# EAGLE design picoPromSD (EAGLE 9.5.1)
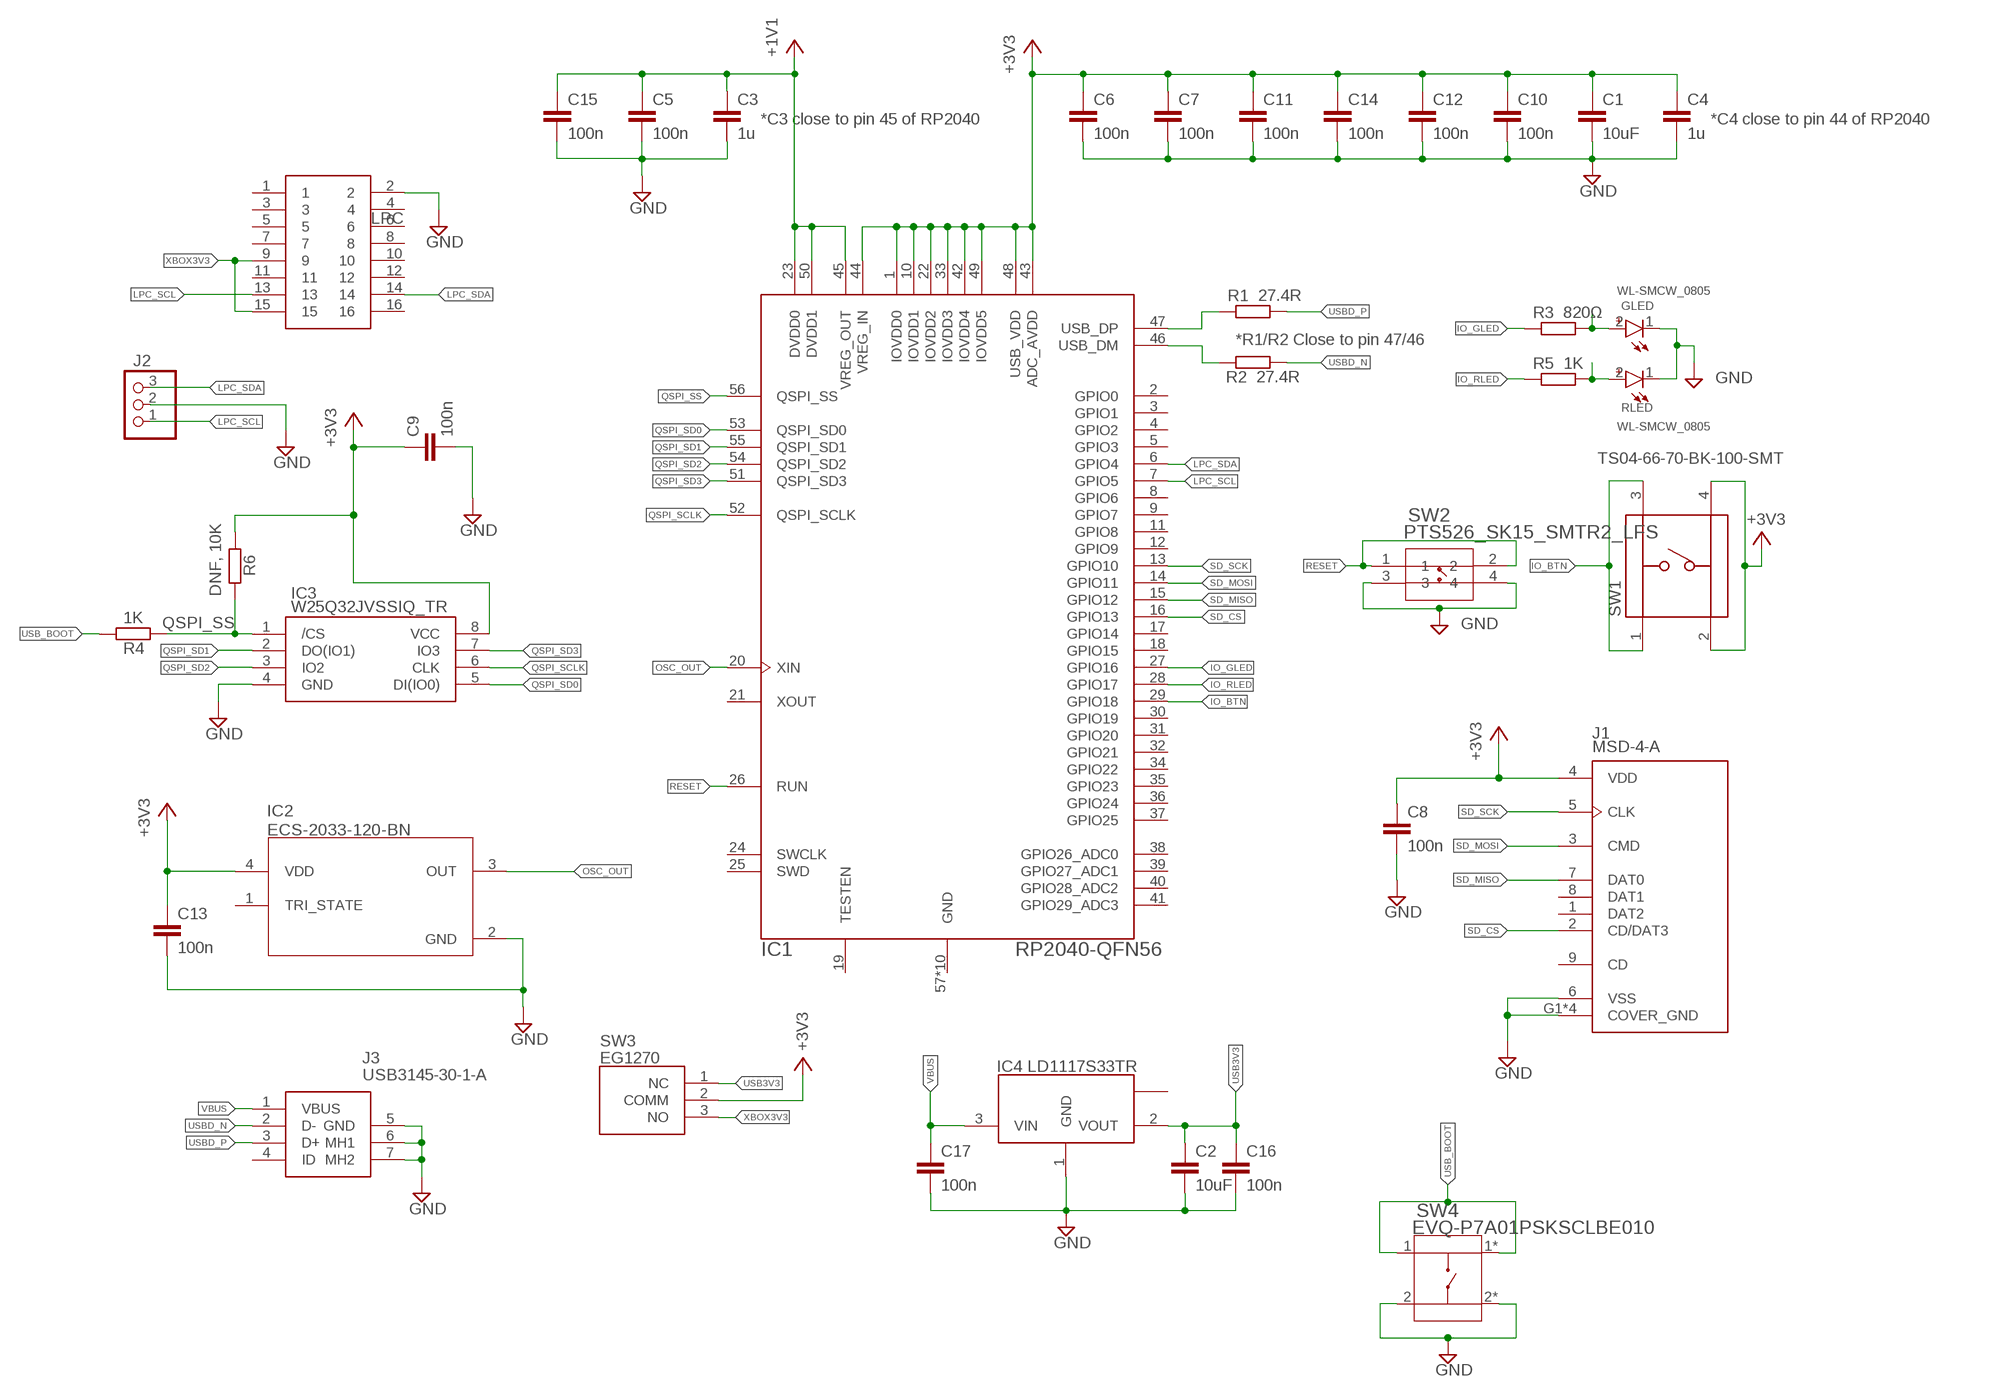
[diagram p0: schematic, sheet 1]

## Parts
C1  10uF  C-EUC0603  [C0603]
C2  10uF  C-EUC0603  [C0603]
C3  1u  CAPACITOR0402  [C0402]
C4  1u  CAPACITOR0402  [C0402]
C5  100n  CAPACITOR0402  [C0402]
C6  100n  CAPACITOR0402  [C0402]
C7  100n  CAPACITOR0402  [C0402]
C8  100n  CAPACITOR0402  [C0402]
C9  100n  CAPACITOR0402  [C0402]
C10  100n  CAPACITOR0402  [C0402]
C11  100n  CAPACITOR0402  [C0402]
C12  100n  CAPACITOR0402  [C0402]
C13  100n  CAPACITOR0402  [C0402]
C14  100n  CAPACITOR0402  [C0402]
C15  100n  CAPACITOR0402  [C0402]
C16  100n  CAPACITOR0402  [C0402]
C17  100n  CAPACITOR0402  [C0402]
GLED  WL-SMCW_0805  [WL-SMCW_0805]
IC1  RP2040-QFN56  [RP2040-QFN-56]
IC2  ECS-2033-120-BN  [OSC_ECS-2033-120-BN]
IC3  W25Q32JVSSIQ_TR  [SOIC127P790X216-8N]
IC4  LD1117S33TR  [SOT223]
J1  MSD-4-A  [CUI_MSD-4-A]
J2  PINHEAD_2.54MM_1X3  [PINHEAD_2.54MM_1X3]
J3  USB3145-30-1-A  [USB3145301A]
LPC  PINHEAD_2.54MM_2X8  [PINHEAD_2.54MM_2X8]
R1  27.4R  RESISTOR  [R0402]
R2  27.4R  RESISTOR  [R0402]
R3  820Ω  RESISTOR  [R0402]
R4  1K  RESISTOR  [R0402]
R5  1K  RESISTOR  [R0402]
R6  DNF, 10K  RESISTOR  [R0402]
RLED  WL-SMCW_0805  [WL-SMCW_0805]
SW1  TS04-66-70-BK-100-SMT  [SW_TS04-66-70-BK-100-SMT]
SW2  PTS526_SK15_SMTR2_LFS  [SMT_FS]
SW3  EG1270  [EG1270]
SW4  EVQ-P7A01PSKSCLBE010  [SKSCLBE010]

## Nets
+3V3 [Power]: C1.1 C4.1 C6.1 C7.1 C8.1 C9.1 C10.1 C11.1 C12.1 C13.1 C14.1 IC1.1(IOVDD0) IC1.10(IOVDD1) IC1.22(IOVDD2) IC1.33(IOVDD3) IC1.42(IOVDD4) IC1.43(ADC_AVDD) IC1.44(VREG_IN) IC1.48(USB_VDD) IC1.49(IOVDD5) IC2.4(VDD) IC3.8(VCC) J1.4(VDD) R6.2 SW1.2 SW1.4 SW3.2(COMM)
GND: C1.2 C2.2 C3.2 C4.2 C5.2 C6.2 C7.2 C8.2 C9.2 C10.2 C11.2 C12.2 C13.2 C14.2 C15.2 C16.2 C17.2 GLED.1(-) IC2.2(GND) IC3.4(GND) IC4.1(GND) J1.6(VSS) J1.G1(COVER_GND) J1.G2(COVER_GND) J1.G3(COVER_GND) J1.G4(COVER_GND) J2.2 J3.5(GND) J3.6(MH1) J3.7(MH2) LPC.2 RLED.1(-) SW2.3 SW2.4 SW4.2 SW4.2*(!)
IO_BTN: IC1.29(GPIO18) SW1.1 SW1.3
IO_GLED: IC1.27(GPIO16) R3.1
IO_GLED2: GLED.2(+) R3.2
IO_RLED: IC1.28(GPIO17) R5.1
IO_RLED2: R5.2 RLED.2(+)
LPC_SCL: IC1.7(GPIO5) J2.1 LPC.13
LPC_SDA: IC1.6(GPIO4) J2.3 LPC.14
OSC_OUT: IC1.20(XIN) IC2.3(OUT)
PUSBD_N [USB]: IC1.46(USB_DM) R2.1
PUSBD_P [USB]: IC1.47(USB_DP) R1.1
QSPI_SCLK: IC1.52(QSPI_SCLK) IC3.6(CLK)
QSPI_SD0: IC1.53(QSPI_SD0) IC3.5(DI(IO0))
QSPI_SD1: IC1.55(QSPI_SD1) IC3.2(DO(IO1))
QSPI_SD2: IC1.54(QSPI_SD2) IC3.3(IO2)
QSPI_SD3: IC1.51(QSPI_SD3) IC3.7(IO3)
QSPI_SS: IC1.56(QSPI_SS) IC3.1(/CS) R4.2 R6.1
RESET: IC1.26(RUN) SW2.1 SW2.2
SD_CS: IC1.16(GPIO13) J1.2(CD/DAT3)
SD_MISO: IC1.15(GPIO12) J1.7(DAT0)
SD_MOSI: IC1.14(GPIO11) J1.3(CMD)
SD_SCK: IC1.13(GPIO10) J1.5(CLK)
USB3V3 [Power]: C2.1 C16.1 IC4.2(VOUT) SW3.1(NC)
USB_BOOT: R4.1 SW4.1 SW4.1*(!_2)
USBD_N [USB]: J3.2(D-) R2.2
USBD_P [USB]: J3.3(D+) R1.2
VBUS [Power]: C17.1 IC4.3(VIN) J3.1(VBUS)
VCC: C3.1 C5.1 C15.1 IC1.23(DVDD0) IC1.45(VREG_OUT) IC1.50(DVDD1) ; supply symbol labelled +1V1
XBOX3V3 [Power]: LPC.9 LPC.15 SW3.3(NO)
Unconnected: IC1.2(GPIO0) IC1.3(GPIO1) IC1.4(GPIO2) IC1.5(GPIO3) IC1.8(GPIO6) IC1.9(GPIO7) IC1.11(GPIO8) IC1.12(GPIO9) IC1.17(GPIO14) IC1.18(GPIO15) IC1.19(TESTEN) IC1.21(XOUT) IC1.24(SWCLK) IC1.25(SWD) IC1.30(GPIO19) IC1.31(GPIO20) IC1.32(GPIO21) IC1.34(GPIO22) IC1.35(GPIO23) IC1.36(GPIO24) IC1.37(GPIO25) IC1.38(GPIO26_ADC0) IC1.39(GPIO27_ADC1) IC1.40(GPIO28_ADC2) IC1.41(GPIO29_ADC3) IC2.1(TRI_STATE) IC4.4(HEATSINK) J1.1(DAT2) J1.8(DAT1) J1.9(CD) J3.4(ID) LPC.1 LPC.3 LPC.4 LPC.5 LPC.6 LPC.7 LPC.8 LPC.10 LPC.11 LPC.12 LPC.16

## Notes on the sheet
- *C3 close to pin 45 of RP2040 | *C4 close to pin 44 of RP2040
- *R1/R2 Close to pin 47/46

## Power pins joined to a net without a drawn wire
GND: IC1.57(GND) IC1.58(GND) IC1.59(GND) IC1.60(GND) IC1.61(GND) IC1.62(GND) IC1.63(GND) IC1.64(GND) IC1.65(GND) IC1.66(GND)

## Library data of the parts
C1 C2 = rcl:C-EU: CAPACITOR, European symbol; SPICEPREFIX: C
C3-C17 = PicoPromSDParts:CAPACITOR
GLED RLED = PicoPromSDParts:WL-SMCW_0805: WL-SMCW SMT Mono-color Chip LED Waterclea Characteristics Low energy consumption High reliability Low current requirement Fast switching No UV/IR radiation Smallest SMD LED package for exceptional brightness Top view LED Wide viewing angle Better solder ability Heat dissipation Applications Backlight for mobile and portable device keypads Indoor and outdoor message boards Flat backlight for LCDs, switches and symbols Display for industrial control systems and traffic Miniaturized color effects Pedestrian mark Optical indicators Tabular backlight: LCD, telephone key-press, power-switch, display board Indoor displays Signals Identifiers Backlight for automobile DVD LED General lighting Toys <https://www.we-online.com/catalog/media/o14904v209%20Family_WL-SMCW.jpg> Details see: www.we-online.com/catalog/WL-SMCW <www.we-online.com/catalog/WL-SMCW/?utm_source=eagle_model&utm_medium=description_link&utm_campaign=eisos_eagle> Updated by Ella Wu, 2022-06-16 2022(C) Wurth Elektronik
IC1 = RpiPico:RP2040-QFN56
IC2 = PicoPromSDParts:ECS-2033-120-BN: subminiature SMD oscillators; MANUFACTURER: ECS Inc; PARTREV: 11/15/13; STANDARD: Manufacturer Recommendations
IC3 = W25Q32JVSSIQ_TR:W25Q32JVSSIQ_TR: NOR Flash spiFlash, 32M-bit, DTR, 4Kb Uniform Sector Source: Datasheet <https://www.winbond.com/resource-files/w25q32jv spi revc 08302016.pdf>; DESCRIPTION: NOR Flash spiFlash, 32M-bit, DTR, 4Kb Uniform Sector; HEIGHT: 2.16mm; MANUFACTURER_NAME: Winbond; MANUFACTURER_PART_NUMBER: W25Q32JVSSIQ TR; MOUSER_PART_NUMBER: 454-W25Q32JVSSIQTR; MOUSER_PRICE-STOCK: https://www.mouser.co.uk/ProductDetail/Winbond/W25Q32JVSSIQ-TR?qs=qSfuJ%252Bfl%2Fd73AdQzQa%2FEuA%3D%3D
IC4 = SamacSys_Parts:LD1117S33TR: LDO Voltage Regulators 3.3V 0.8A Positive Source: Datasheet <https://datasheet.lcsc.com/szlcsc/STMicroelectronics-LD1117S33TR_C86781.pdf>
J1 = PicoPromSDParts:MSD-4-A; MANUFACTURER: CUI Devices; MAXIMUM_PACKAGE_HEIGHT: 2.00mm; PARTREV: 1.0; STANDARD: Manufacturer Recommendations
J2 = PicoPromSDParts:PINHEAD_2.54MM_1X3
J3 = USB3145-30-1-A:USB3145-30-1-A: GCT (GLOBAL CONNECTOR TECHNOLOGY) - USB3145-30-1-A - MICRO USB, 2.0 TYPE B, RECEPTACLE, TH Source: Datasheet; DESCRIPTION: GCT (GLOBAL CONNECTOR TECHNOLOGY) - USB3145-30-1-A - MICRO USB, 2.0 TYPE B, RECEPTACLE, TH; HEIGHT: mm; MANUFACTURER_NAME: GCT (GLOBAL CONNECTOR TECHNOLOGY); MANUFACTURER_PART_NUMBER: USB3145-30-1-A; MOUSER_PART_NUMBER: 640-USB3145-30-1-A; MOUSER_PRICE-STOCK: https://www.mouser.co.uk/ProductDetail/GCT/USB3145-30-1-A?qs=KUoIvG%2F9IlYD1lvSRu5iyg%3D%3D
LPC = PicoPromSDParts:PINHEAD_2.54MM_2X8
R1-R6 = PicoPromSDParts:RESISTOR
SW1 = SamacSys_Parts:TS04-66-70-BK-100-SMT: Check availability <https://pricing.snapeda.com/parts/TS04-66-70-BK-100-SMT/CUI%20Devices/view-part?ref=eda>; AVAILABILITY: In Stock; CUI_PURCHASE_URL: https://www.cuidevices.com/product/switches/tactile-switches/ts04-series?utm_source=snapeda.com&utm_medium=referral&utm_campaign=snapedaBOM; DESCRIPTION: 6 x 6 mm, 4.3~9.5 mm Actuator Height, 100~260 gf, Surface Mount, SPST, Tactile Switch; MF: CUI Devices; MP: TS04-66-70-BK-100-SMT; PACKAGE: None; PRICE: None; PURCHASE-URL: https://pricing.snapeda.com/search/part/TS04-66-70-BK-100-SMT/?ref=eda
SW2 = PicoPromSDParts:PTS526_SK15_SMTR2_LFS; COPYRIGHT: Copyright (C) 2024 Ultra Librarian. All rights reserved.; MANUFACTURER_PART_NUMBER: PTS526 SK15 SMTR2 LFS; MFR_NAME: C&K Components
SW3 = EG1270:EG1270: E-SWITCH - EG1270 - SWITCH, SLIDE, SPDT, 300mA, 6V, PCB Source: Datasheet <https://componentsearchengine.com/Datasheets/1/EG1270.pdf>; DESCRIPTION: E-SWITCH - EG1270 - SWITCH, SLIDE, SPDT, 300mA, 6V, PCB; HEIGHT: 4.6mm; MANUFACTURER_NAME: E-Switch; MANUFACTURER_PART_NUMBER: EG1270; MOUSER_PART_NUMBER: 612-EG1270; MOUSER_PRICE-STOCK: https://www.mouser.co.uk/ProductDetail/E-Switch/EG1270?qs=xDsBkp9LkodMM2ilVTltow%3D%3D
SW4 = PicoPromSDParts:EVQ-P7A01P

## Net classes
1 USB: width 0.24 mm
2 Power: width 0.006 mm

## Board
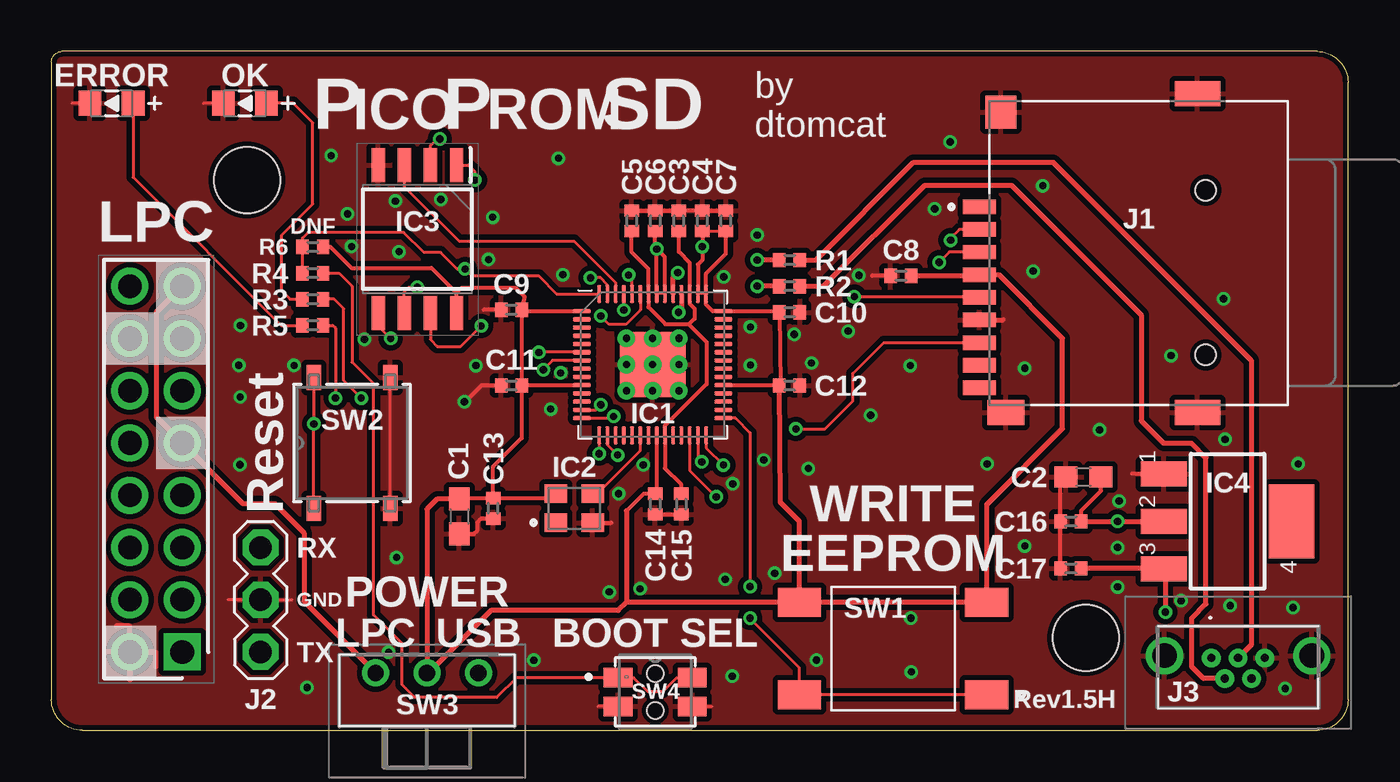
[diagram p1: board, top side]
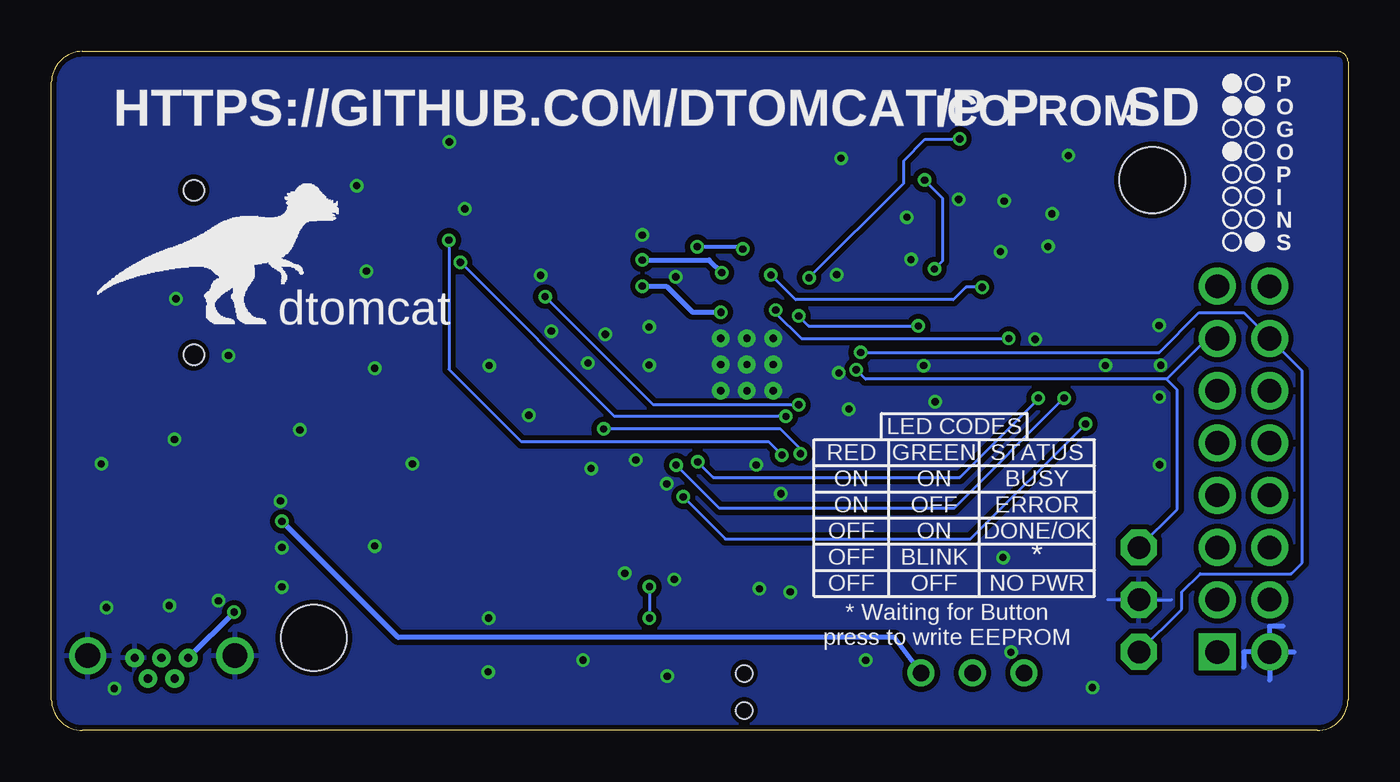
[diagram p2: board, bottom side, seen from below]

Size 63 x 33 mm. Coordinates in mm from the lower left corner, seen from the top.
Outline: 1.5,0 61.5,0 arc90 63,1.5 63,31.5 arc90 61.5,33 0.5,33 arc90 0,32.5 0,1.5 arc90 1.5,0
Copper layers (1*16): Top 0.035mm / dielectric 1.5mm / Bottom 0.035mm
Design rules "pcbway-20170911": minimum track width 6mil, minimum drill 0.3mm, track to track 6mil, track to pad 6mil, pad to pad 6mil, via to via 6mil, smd to smd 0mil, copper to edge 10mil, drill to drill 10mil, minimum pad ring 10mil, minimum via ring 6mil, stop-mask expansion 2mil, vias tented up to drill 100mil, thermal gap 10mil
Holes 3.2 mm at 50.25,4.5 9.5,26.75

### Footprints (pad centres in the part's own frame; a part is rotated, then mirrored left to right if it is on the bottom)
C0603 = smd 1.1 x 1: 1 -0.85,0; 2 0.85,0
C0402 = smd 0.6 x 0.7: 1 -0.5,0; 2 0.5,0
WL-SMCW_0805 = smd 1.1 x 1.2: 1 -1.05,0; 2 1.05,0
RP2040-QFN-56 = smd 0.875 x 0.2: 1 -3.438,2.6; 2 -3.438,2.2; 3 -3.438,1.8; 4 -3.438,1.4; 5 -3.438,1; 6 -3.438,0.6; 7 -3.438,0.2; 8 -3.438,-0.2; 9 -3.438,-0.6; 10 -3.438,-1; 11 -3.438,-1.4; 12 -3.438,-1.8; 13 -3.438,-2.2; 14 -3.438,-2.6; 29 3.438,-2.6; 30 3.438,-2.2; 31 3.438,-1.8; 32 3.438,-1.4; 33 3.438,-1; 34 3.438,-0.6; 35 3.438,-0.2; 36 3.438,0.2; 37 3.438,0.6; 38 3.438,1; 39 3.438,1.4; 40 3.438,1.8; 41 3.438,2.2; 42 3.438,2.6 | smd 0.2 x 0.875: 15 -2.6,-3.438; 16 -2.2,-3.438; 17 -1.8,-3.438; 18 -1.4,-3.438; 19 -1,-3.438; 20 -0.6,-3.438; 21 -0.2,-3.438; 22 0.2,-3.438; 23 0.6,-3.438; 24 1,-3.438; 25 1.4,-3.438; 26 1.8,-3.438; 27 2.2,-3.438; 28 2.6,-3.438; 43 2.6,3.438; 44 2.2,3.438; 45 1.8,3.438; 46 1.4,3.438; 47 1,3.438; 48 0.6,3.438; 49 0.2,3.438; 50 -0.2,3.438; 51 -0.6,3.438; 52 -1,3.438; 53 -1.4,3.438; 54 -1.8,3.438; 55 -2.2,3.438; 56 -2.6,3.438 | smd 3.2 x 3.2: 57 0,0 | drill 0.35 pad 0.6: 58 -1.275,1.275; 59 0,1.275; 60 1.275,1.275; 61 -1.275,0; 62 0,0; 63 1.275,0; 64 -1.275,-1.275; 65 0,-1.275; 66 1.275,-1.275
OSC_ECS-2033-120-BN = smd 1.1 x 0.9: 1 -0.9,-0.7; 2 0.9,-0.7; 3 0.9,0.7; 4 -0.9,0.7
SOIC127P790X216-8N = smd 1.65 x 0.65: 1 -3.6,1.905; 2 -3.6,0.635; 3 -3.6,-0.635; 4 -3.6,-1.905; 5 3.6,-1.905; 6 3.6,-0.635; 7 3.6,0.635; 8 3.6,1.905
SOT223 = smd 1.219 x 2.235: 1 -2.311,-3.099; 2 0,-3.099; 3 2.311,-3.099 | smd 3.6 x 2.2: 4 0,3.099
CUI_MSD-4-A = smd 0.7 x 1.6: 1 2.25,7.75; 2 1.15,7.75; 3 0.05,7.75; 4 -1.05,7.75; 5 -2.15,7.75; 6 -3.25,7.75; 7 -4.35,7.75; 8 -5.45,7.75; 9 -6.55,7.75 | smd 1.2 x 1.8: G1 -7.75,6.45 | smd 1.6 x 1.5: G2 6.85,6.7 | smd 1.2 x 2.2: G3 -7.75,-2.85; G4 7.75,-2.85 | hole 1: -4.95,-3.25; 3.05,-3.25
PINHEAD_2.54MM_1X3 = drill 1.1 pad 1.75 octagon: 1 2.54,0; 2 0,0; 3 -2.54,0
USB3145301A = drill 0.4 pad 0.8: 1 -1.3,0.22; 2 -0.65,-0.78; 3 0,0.22; 4 0.65,-0.78; 5 1.3,0.22 | drill 1.202 pad 1.803: 6 -3.575,0.33; 7 3.575,0.33
PINHEAD_2.54MM_2X8 = drill 1.15 pad 1.8 square: 1 -8.89,-1.27 | drill 1.15 pad 1.8: 2 -8.89,1.27; 3 -6.35,-1.27; 4 -6.35,1.27; 5 -3.81,-1.27; 6 -3.81,1.27; 7 -1.27,-1.27; 8 -1.27,1.27; 9 1.27,-1.27; 10 1.27,1.27; 11 3.81,-1.27; 12 3.81,1.27; 13 6.35,-1.27; 14 6.35,1.27; 15 8.89,-1.27; 16 8.89,1.27
R0402 = smd 0.6 x 0.7: 1 -0.5,0; 2 0.5,0
SW_TS04-66-70-BK-100-SMT = smd 2.1 x 1.4: 1 -4.55,2.25; 2 -4.55,-2.25; 3 4.55,2.25; 4 4.55,-2.25
SMT_FS = smd 1.2 x 0.7: 1 -3.181,1.854; 2 3.181,1.854; 3 -3.181,-1.854; 4 3.181,-1.854
EG1270 = drill 0.8 pad 1.3: 1 0,0; 2 0,2.5; 3 0,5
SKSCLBE010 = smd 1.4 x 0.95: 1 -1.8,0.7; 1* 1.8,0.7; 2 -1.8,-0.7; 2* 1.8,-0.7 | hole 0.8: 0,0.9; 0,-0.9

### Placement (x,y rotation side)
C1  19.81,10.4 270 top
C2  50.14,12.32 180 top
C3  30.48,24.77 90 top
C4  31.62,24.77 90 top
C5  28.19,24.77 90 top
C6  29.34,24.77 90 top
C7  32.77,24.77 90 top
C8  41.27,22.1 180 top
C9  22.35,20.45 180 top
C10  35.86,20.32 0 top
C11  22.35,16.76 180 top
C12  35.86,16.76 0 top
C13  21.46,10.79 270 top
C14  29.34,11 270 top
C15  30.61,11 270 top
C16  49.53,10.16 180 top
C17  49.53,7.87 180 top
GLED  9.4,30.48 0 top
IC1  29.21,17.78 0 top
IC2  25.4,10.79 0 top
IC3  17.78,23.88 270 top
IC4  57.15,10.16 270 top
J1  52.83,23.2 90 top
J2  10.16,6.35 90 top
J3  57.66,3.3 0 top
LPC  5.08,12.7 90 top
R1  35.86,22.86 0 top
R2  35.86,21.59 0 top
R3  12.7,20.95 180 top
R4  12.7,22.23 180 top
R5  12.7,19.68 180 top
R6  12.7,23.5 0 top
RLED  2.92,30.48 0 top
SW1  40.89,3.98 180 top
SW2  14.61,13.97 90 top
SW3  20.75,2.79 90 top
SW4  29.34,1.87 0 top
U$1  [POGO_SILK]  5.08,27.6 0 bottom

### Tracks (layer width: path | path; a pad name or v marks a point on that pad's centre or on a via)
+3V3  (via drill 0.35)
  Top 0.152: IC1.44 31.5,21.25 31.75,21.25 IC1.43 | IC1.48 29.75,21.25 29.5,21.25 IC1.49 | C4.1 C7.1
  Top 0.203: C4.1 v31.62,23.51 31.62,22.86 31.41,22.65 IC1.44 | IC1.33 35.4,16.78 | 35.4,16.78 C12.1 | 35.4,16.78 35.42,16.8 C10.1 35.36,20.38 IC1.42 32.12,20.38 31.81,20.69 IC1.43 31.81,22.21 32.77,23.17 C7.1 | IC3.8 19.68,21.26 | 19.68,21.26 19.91,21.49 22.58,21.49 23,21.07 C9.1 | R6.2 13.56,23.5 14.58,22.48 18.47,22.48 19.68,21.26 | C6.1 29.34,23.47 v29.41,23.4 | IC1.48 29.81,23 v29.41,23.4 | IC1.49 v29.41,23.4 | C9.1 23.07,20.38 IC1.1 | C9.1 C11.1 | IC1.22 29.41,11.52 C14.1 28.77,11.5 27.94,10.67 | C11.1 22.85,14.21 21.46,12.82 C13.1 | IC1.10 25.76,16.76 C11.1 | C1.1 19.86,11.29 C13.1 | C13.1 24.3,11.29 IC2.4
  Top 0.254: SW1.4 SW1.2 45.44,10.99 49.12,14.68 49.12,19.05 46.02,22.15 J1.4 45.03,22.1 C8.1 | C12.1 35.42,11.09 36.34,10.16 SW1.4 | SW1.4 27.94,6.23 | 27.94,10.67 27.94,6.23 | 27.94,6.23 27.54,5.83 21.36,5.83 18.25,2.72 SW3.2 18.25,10.76 18.74,11.25 C1.1
  Bottom 0.203: v29.41,23.4 29.52,23.51 v31.62,23.51
GND  (via drill 0.35)
  Top 0.152: SW4.2 26.55,1.17 | SW4.2* 32.09,1.17 | 8.59,6.35 J2.2 11.68,6.35 | RLED.1 0.99,30.48 | GLED.1 7.39,30.48 | SW2.3 SW2.4
  Top 0.203: C2.2 49.18,12.26 | 49.18,12.26 48.88,12.11 | C17.2 C16.2 49.03,12.12 49.18,12.26 | C8.2 39.88,22.1 | IC4.1 52.5,12.47 | C5.2 C6.2 C3.2 C4.2 C7.2 | C9.2 21.01,20.45 | C14.2 C15.2 | IC2.2 27.19,10.1 | C11.2 20.9,16.76 20.12,15.98 v20.07,15.98 | C1.2 20.52,9.55 20.7,9.73 20.7,10.11 20.89,10.29 C13.2
  Top 0.254: LPC.2 2.62,3.81 | LPC.2 3.81,2.44 | LPC.2 3.81,5.07 3.12,5.07 | LPC.2 5.07,3.81 5.07,3.1 | J1.6 46.25,19.95
  Bottom 0.152: 11.68,6.35 J2.2 8.59,6.35
  Bottom 0.254: LPC.2 3.81,2.44 | LPC.2 2.62,3.81 | LPC.2 3.81,5.07 3.15,5.07 | LPC.2 5.07,3.81 5.07,3.07
  other vias: 35.14,7.63 13.59,27.94 24.64,27.81 43.66,28.6 48.17,26.47 47.7,22.32 47.29,17.6 50.93,14.61 45.47,12.95 51.8,6.97 41.78,2.84 36.93,17.86 32.74,7.34 60.33,5.97 60.58,12.95 56.95,20.98 59.94,2.03 9.1,17.75 9.15,12.92 41.76,5.46 24.26,15.62 33.96,19.61 33.96,17.75 24.84,22.15 21.23,22.89 54.4,18.21 42.91,25.35 39.23,22.12 57.28,6.07 57.02,14.15 41.73,17.73 39.8,15.32 36.78,12.73 36.09,19.25 47.29,8.97 54.89,6.3 34.29,24.08 24.74,17.37 20.62,17.73 9.17,16.21 32.66,22.05 21.44,24.94 27.1,6.73 51.8,8.89 51.88,11.15 38.71,19.41 18.92,25.81 34.61,13.15 37.17,3.42 33.08,2.63 16.76,8.41 27.56,11.51 28.75,12.9 23.44,3.41 12.42,2.08 15.21,19.01 16.71,25.73 16.89,23.27 14.58,23.52 28.6,6.88 16.38,3.8 33.1,11.98 14.39,25.11 9.18,19.68 11.79,17.74
  pour Top (isolate 0.254): -1.27,34.29 -1.27,-1.27 64.77,-1.27 64.77,33.02 63.5,34.29
  pour Bottom (isolate 0.254): -1.27,34.29 -1.27,-1.27 63.5,-1.27 63.5,34.29
IO_BTN  (via drill 0.35)
  Top 0.152: SW1.1 SW1.3 36.34,3.05 33.95,5.45 v33.95,5.46 | IC1.29 33.23,15.18 33.95,14.46 v33.95,6.99
  Bottom 0.152: v33.95,6.99 v33.95,5.46
IO_GLED  (via drill 0.35)
  Top 0.152: R3.1 13.74,20.95 14.2,20.5 14.2,17 v15.05,16.15 | IC1.27 31.41,13.24 v31.6,13.05
  Bottom 0.152: v31.6,13.05 30.85,12.3 18.86,12.3 17.1,14.07 17.08,14.07 15.05,16.1 v15.05,16.15
IO_GLED2
  Top 0.152: R3.2 11.59,20.95 11.18,21.37 11.18,24.07 12.7,25.59 12.7,29.53 11.75,30.48 GLED.2
IO_RLED  (via drill 0.35)
  Top 0.152: IC1.28 31.81,13.74 v32.65,12.9 | R5.1 13.66,19.68 13.8,19.55 v13.8,16.15
  Bottom 0.152: v32.65,12.9 30.55,10.8 19.15,10.8 v13.8,16.15
IO_RLED2
  Top 0.152: RLED.2 3.97,26.88 11.16,19.68 R5.2
LPC_SCL  (via drill 0.35)
  Top 0.152: IC1.7 24.34,17.98 v23.89,17.53
  Bottom 0.152: v23.89,17.53 23.44,17.07 8.82,17.07 | J2.1 8.3,10.75 8.3,16.55 8.82,17.07 | LPC.13 6.83,19.05 8.81,17.07 8.82,17.07
LPC_SDA  (via drill 0.35)
  Top 0.152: IC1.6 v23.69,18.38 v23.68,18.37
  Bottom 0.152: v23.68,18.37 9.18,18.37 7.25,20.3 5.06,20.3 LPC.14 2.23,17.48 2.23,8.15 2.77,7.62 7.19,7.62 8.08,6.73 8.08,5.89 J2.3
OSC_OUT
  Top 0.152: IC1.20 28.61,13.6 26.51,11.49 IC2.3
PUSBD_N  (via drill 0.35)
  Top 0.24: R2.1 v34.29,21.59 | IC1.46 30.61,20.46 v30.47,20.33
  Bottom 0.24: v34.29,21.59 33.12,21.59 31.85,20.33 v30.47,20.33
PUSBD_P  (via drill 0.35)
  Top 0.24: IC1.47 30.21,22.03 v30.43,22.25 | R1.1 v34.29,22.86
  Bottom 0.24: v34.29,22.86 31.04,22.86 v30.43,22.25
QSPI_SCLK  (via drill 0.35)
  Top 0.152: IC3.6 17.14,21.31 17.37,21.54 v17.78,21.54 | IC1.52 28.21,21.93 28.04,22.1 v28.04,22.14
  Bottom 0.152: v17.78,21.54 18.57,21.54 19.18,20.93 26.84,20.93 v28.04,22.14
QSPI_SD0  (via drill 0.35)
  Top 0.152: IC3.5 15.88,19.66 v16.48,19.05 | IC1.53 v27.81,20.43
  Bottom 0.152: v16.48,19.05 26.57,19.05 27.81,20.29 v27.81,20.43
QSPI_SD1  (via drill 0.35)
  Top 0.152: IC1.55 27.01,21.66 26.67,22 v26.19,22 | IC3.2 18.41,28.42 18.75,28.75 v18.87,28.75
  Bottom 0.152: v26.19,22 v26.18,22 21.59,26.59 21.59,27.69 20.55,28.73 18.9,28.73 v18.87,28.75
QSPI_SD2
  Top 0.152: IC3.3 17.14,26.44 19.81,23.77 25.4,23.77 27.41,21.76 IC1.54
QSPI_SD3  (via drill 0.35)
  Top 0.152: IC3.7 18.41,19 18.75,18.67 19.89,18.67 v20.88,19.66 | IC1.51 28.61,20.43 27.92,19.74 27.1,19.74 v26.69,20.14
  Bottom 0.152: v26.69,20.14 26.21,19.66 v20.88,19.66
QSPI_SS  (via drill 0.35)
  Top 0.152: IC3.1 20.25,27.48 20.57,27.15 v20.57,26.75 | IC1.56 24.55,21.22 23.7,22.07 20.45,22.07 v20.09,22.43 19.71,22.43 18.91,23.23 18.1,23.23 17.12,24.21 12.47,24.21 12.2,23.93 R6.1 R4.2
  Bottom 0.152: v20.09,22.43 19.71,22.81 19.71,25.88 v20.57,26.75
RESET  (via drill 0.35)
  Top 0.152: v32.3,11.35 31.01,12.64 IC1.26 | SW2.2 v12.75,14.9 SW2.1
  Bottom 0.152: v32.3,11.35 30.25,9.3 18.35,9.3 v12.75,14.9
SD_CS  (via drill 0.35)
  Top 0.152: v43.69,23.83 43.69,23.93 44.11,24.35 J1.2 | IC1.16 27.01,13.88 v27.51,13.39
  Bottom 0.152: v27.51,13.39 28.14,14.02 40.16,14.02 43.69,17.55 v43.69,23.83
SD_MISO  (via drill 0.35)
  Top 0.152: IC1.15 v26.61,13.45 | v36.17,14.66 37.59,14.66 38.94,16 38.94,17.35 40.44,18.85 J1.7
  Bottom 0.152: v26.61,13.45 26.61,13.68 27.58,14.66 v36.17,14.66
SD_MOSI  (via drill 0.35)
  Top 0.152: v27.32,15.26 27.24,15.18 IC1.14 | v43.13,22.75 43.63,23.25 J1.3
  Bottom 0.152: v27.32,15.26 35.64,15.26 v43.13,22.75
SD_SCK  (via drill 0.35)
  Top 0.152: v26.7,15.82 26.45,15.58 IC1.13 | v39.01,21.08 45.05,21.08 J1.5
  Bottom 0.152: v39.01,21.08 33.76,15.82 v26.7,15.82
USB3V3  (via drill 0.35)
  Top 0.203: C16.1 50.03,10.69 50.99,11.64 C2.1
  Top 0.254: C16.1 v51.8,10.16 IC4.2
  Bottom 0.254: SW3.1 22.04,4.51 46.15,4.51 v51.8,10.16
USB_BOOT
  Top 0.152: SW4.1* 30.38,2.57 29.72,1.91 28.96,1.91 28.29,2.57 SW4.1 22.59,2.57 21.63,1.6 17.65,1.6 17.03,2.22 17.03,4.23 15.65,5.61 15.65,16.85 14.6,17.9 14.6,21.59 13.97,22.23 R4.1
USBD_N
  Top 0.24: R2.2 37.52,21.59 42.43,26.5 46.65,26.5 52.95,20.2 52.95,15.05 54.05,13.95 55.4,13.95 56.1,13.25 56.1,6.15 55.4,5.45 55.4,3.1 55.98,2.52 J3.2
USBD_P
  Top 0.24: J3.3 58.3,4.16 58.3,17.98 48.66,27.62 41.89,27.62 37.14,22.86 R1.2
VBUS  (via drill 0.35)
  Top 0.152: 50.25,7.88 C17.1 | 54,7.88 IC4.3 54.12,7.75
  Top 0.254: 54,7.88 50.25,7.88 | 54.12,7.75 v54.12,5.75
  Bottom 0.152: J3.1
  Bottom 0.254: v54.12,5.75 J3.1
VCC
  Top 0.203: C15.1 30.61,11.94 29.81,12.74 IC1.23 29.81,14.81 31.83,16.83 31.83,18.87 30.98,19.73 30.98,19.75 | C3.1 30.48,23.26 31.01,22.73 IC1.45 31.01,20.74 31.25,20.5 31.25,20.02 30.98,19.75 | 30.98,19.75 29.84,19.75 29.01,20.57 IC1.50 29.01,22.43 28.19,23.24 C5.1
XBOX3V3
  Top 0.254: LPC.15 5.1,20.34 5.1,15.22 LPC.9 9.3,11.02 10.85,11.02 12.27,9.6 12.27,6.27 SW3.3

### Text on the board
tPlace: ERROR | OK | P | ICO | P | ROM | SD | by / dtomcat | C5 | C6 | C3 | C4 | C7 | LPC | DNF | IC3 | J1 | R6 | R1 | C8 | R4 | R2 | R3 | C9 | R5 | C10 | C11 | C12 | SW2 | IC1 | Reset | C1 | C13 | IC2 | C2 | IC4 | C14 | C15 | WRITE | C16 | RX | EEPROM | C17 | GND | POWER | SW1 | TX | LPC | USB | BOOT SEL | J2 | SW3 | SW4 | Rev1.5H | J3
bPlace: P | O | G | SD | ROM | P | ICO | HTTPS://GITHUB.COM/DTOMCAT/P | O | P | I | N | S | dtomcat | LED CODES | STATUS | GREEN | RED | BUSY | ON | ON | ERROR | OFF | ON | DONE/OK | ON | OFF | * | BLINK | OFF | NO PWR | OFF | OFF | * Waiting for Button / press to write EEPROM